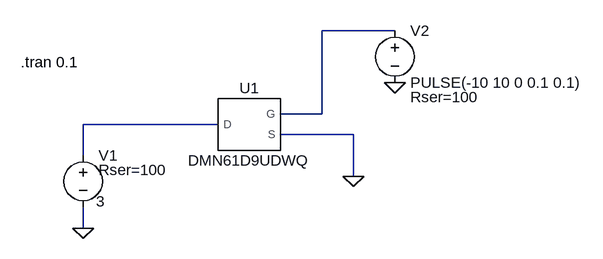
[diagram p0: schematic drawing.asc]
drawing.asc, the LTspice schematic file:
Version 4
SHEET 1 880 680
WIRE 432 16 320 16
WIRE 320 144 320 16
WIRE 320 144 256 144
WIRE 160 160 -48 160
WIRE 368 176 256 176
WIRE -48 208 -48 160
WIRE 368 240 368 176
WIRE -48 320 -48 288
FLAG -48 320 0
FLAG 368 240 0
FLAG 432 96 0
SYMBOL DMN61D9UDWQ 208 160 R0
SYMATTR InstName U1
SYMBOL voltage -48 192 R0
WINDOW 123 0 0 Left 0
WINDOW 39 24 38 Left 2
WINDOW 3 20 87 Left 2
SYMATTR SpiceLine Rser=100
SYMATTR Value 3
SYMATTR InstName V1
SYMBOL voltage 432 0 R0
WINDOW 123 0 0 Left 0
WINDOW 39 24 118 Left 2
SYMATTR SpiceLine Rser=100
SYMATTR InstName V2
SYMATTR Value PULSE(-10 10 0 0.1 0.1)
TEXT -144 64 Left 2 !.tran 0.1

The netlist it stands for:
* drawing.asc
XU1 N002 N001 0 DMN61D9UDWQ  ; pins D G S
V1 N002 0 3 Rser=100
V2 N001 0 PULSE(-10 10 0 0.1 0.1) Rser=100
.tran 0.1
.lib DMN61D9UDWQ.spice.txt
.backanno
.end